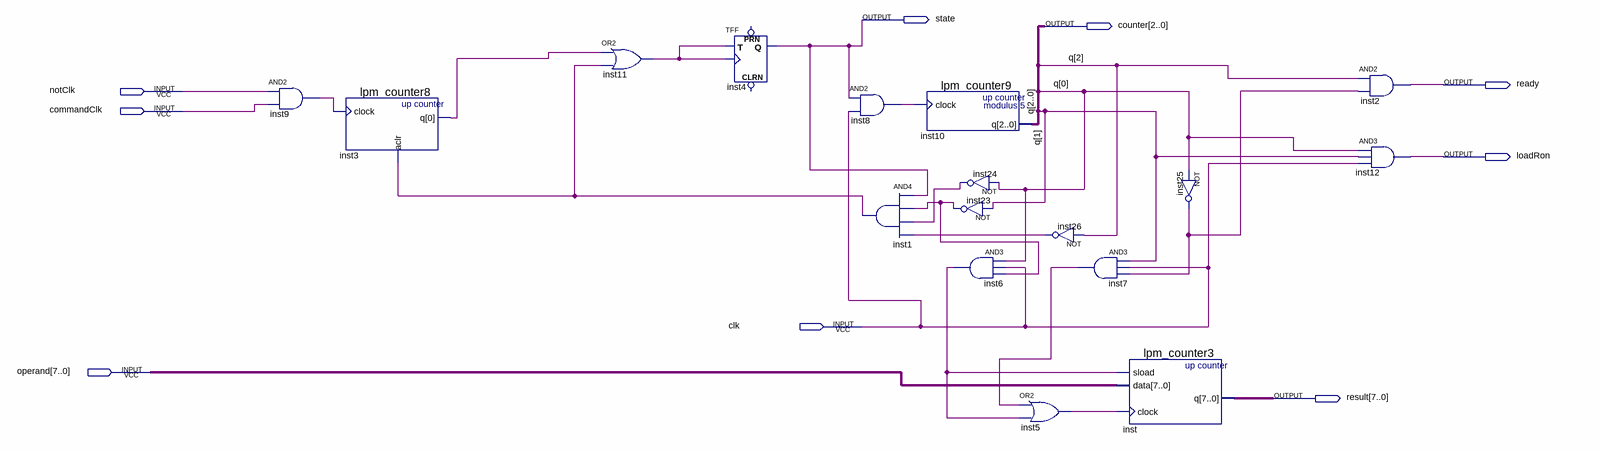
[diagram p0: schematic sheet]
// Quartus schematic NOT.bdf as structural Verilog: 17 symbols, 9 pins
module NOT (
  input  notClk,
  input  commandClk,
  input  clk,
  input  [7:0] operand,
  output state,
  output [2:0] counter,
  output ready,
  output loadRon,
  output [7:0] result
);

  wire inst1_out, inst3_q, inst5_out, inst6_out, inst7_out, inst8_out, inst9_out, inst11_out, inst23_out,
       inst24_out, inst25_out, inst26_out;

  and inst9 (inst9_out, notClk, commandClk);
  lpm_counter8 inst3 (.clock(inst9_out), .aclr(inst1_out), .q(inst3_q));
  or inst11 (inst11_out, inst3_q, inst1_out);
  TFF inst4 (.T(inst11_out), .CLK(inst11_out), .Q(state));  // open: PRN, CLRN
  and inst8 (inst8_out, state, clk);
  and inst1 (inst1_out, state, inst23_out, inst24_out, inst26_out);
  lpm_counter9 inst10 (.clock(inst8_out), .q(counter));
  not inst23 (inst23_out, counter[1]);
  and inst6 (inst6_out, counter[0], clk, inst23_out);
  not inst24 (inst24_out, counter[0]);
  not inst26 (inst26_out, counter[2]);
  or inst5 (inst5_out, inst7_out, inst6_out);
  and inst7 (inst7_out, counter[1], clk, inst25_out);
  lpm_counter3 inst (.sload(inst6_out), .data(operand), .clock(inst5_out), .q(result));
  not inst25 (inst25_out, counter[0]);
  and inst2 (ready, counter[2], inst25_out);
  and inst12 (loadRon, counter[0], counter[1], clk);

  // Other names for the same wires on the sheet: q[2:0] = counter
endmodule
